# Altium schematic sheet S11830_1_1.SchDoc
size A4
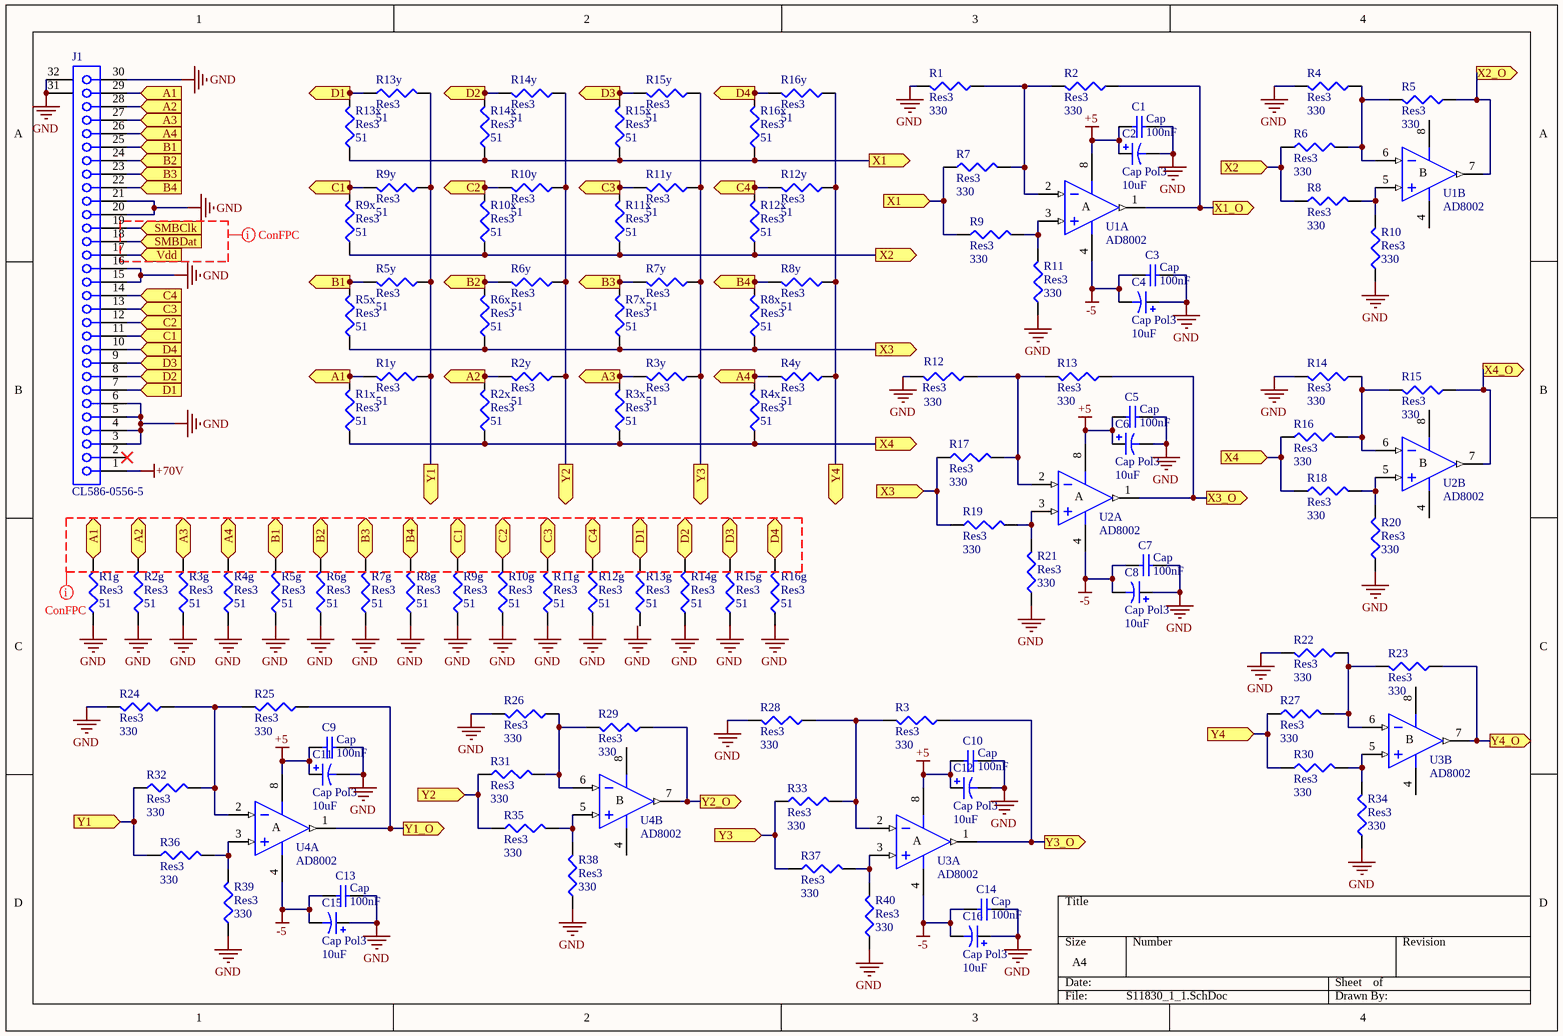
[diagram p0: S11830_1_1.SchDoc]

## Parts
C1  Cap  value 100nF  [6-0805_N]
C2  Cap Pol3  value 10uF  [6-0805_N]
C3  Cap  value 100nF  [6-0805_N]
C4  Cap Pol3  value 10uF  [6-0805_N]
C5  Cap  value 100nF  [6-0805_N]
C6  Cap Pol3  value 10uF  [6-0805_N]
C7  Cap  value 100nF  [6-0805_N]
C8  Cap Pol3  value 10uF  [6-0805_N]
C9  Cap  value 100nF  [6-0805_N]
C10  Cap  value 100nF  [6-0805_N]
C11  Cap Pol3  value 10uF  [6-0805_N]
C12  Cap Pol3  value 10uF  [6-0805_N]
C13  Cap  value 100nF  [6-0805_N]
C14  Cap  value 100nF  [6-0805_N]
C15  Cap Pol3  value 10uF  [6-0805_N]
C16  Cap Pol3  value 10uF  [6-0805_N]
J1  CL586-0556-5  [FH12A-30S-0.5SH]
R1  Res3  value 330  [J1-0603]
R1g  Res3  value 51  [0402]
R1x  Res3  value 51  [0402]
R1y  Res3  value 51  [0402]
R2  Res3  value 330  [J1-0603]
R2g  Res3  value 51  [0402]
R2x  Res3  value 51  [0402]
R2y  Res3  value 51  [0402]
R3  Res3  value 330  [J1-0603]
R3g  Res3  value 51  [0402]
R3x  Res3  value 51  [0402]
R3y  Res3  value 51  [0402]
R4  Res3  value 330  [J1-0603]
R4g  Res3  value 51  [0402]
R4x  Res3  value 51  [0402]
R4y  Res3  value 51  [0402]
R5  Res3  value 330  [J1-0603]
R5g  Res3  value 51  [0402]
R5x  Res3  value 51  [0402]
R5y  Res3  value 51  [0402]
R6  Res3  value 330  [J1-0603]
R6g  Res3  value 51  [0402]
R6x  Res3  value 51  [0402]
R6y  Res3  value 51  [0402]
R7  Res3  value 330  [J1-0603]
R7g  Res3  value 51  [0402]
R7x  Res3  value 51  [0402]
R7y  Res3  value 51  [0402]
R8  Res3  value 330  [J1-0603]
R8g  Res3  value 51  [0402]
R8x  Res3  value 51  [0402]
R8y  Res3  value 51  [0402]
R9  Res3  value 330  [J1-0603]
R9g  Res3  value 51  [0402]
R9x  Res3  value 51  [0402]
R9y  Res3  value 51  [0402]
R10  Res3  value 330  [J1-0603]
R10g  Res3  value 51  [0402]
R10x  Res3  value 51  [0402]
R10y  Res3  value 51  [0402]
R11  Res3  value 330  [J1-0603]
R11g  Res3  value 51  [0402]
R11x  Res3  value 51  [0402]
R11y  Res3  value 51  [0402]
R12  Res3  value 330  [J1-0603]
R12g  Res3  value 51  [0402]
R12x  Res3  value 51  [0402]
R12y  Res3  value 51  [0402]
R13  Res3  value 330  [J1-0603]
R13g  Res3  value 51  [0402]
R13x  Res3  value 51  [0402]
R13y  Res3  value 51  [0402]
R14  Res3  value 330  [J1-0603]
R14g  Res3  value 51  [0402]
R14x  Res3  value 51  [0402]
R14y  Res3  value 51  [0402]
R15  Res3  value 330  [J1-0603]
R15g  Res3  value 51  [0402]
R15x  Res3  value 51  [0402]
R15y  Res3  value 51  [0402]
R16  Res3  value 330  [J1-0603]
R16g  Res3  value 51  [0402]
R16x  Res3  value 51  [0402]
R16y  Res3  value 51  [0402]
R17  Res3  value 330  [J1-0603]
R18  Res3  value 330  [J1-0603]
R19  Res3  value 330  [J1-0603]
R20  Res3  value 330  [J1-0603]
R21  Res3  value 330  [J1-0603]
R22  Res3  value 330  [J1-0603]
R23  Res3  value 330  [J1-0603]
R24  Res3  value 330  [J1-0603]
R25  Res3  value 330  [J1-0603]
R26  Res3  value 330  [J1-0603]
R27  Res3  value 330  [J1-0603]
R28  Res3  value 330  [J1-0603]
R29  Res3  value 330  [J1-0603]
R30  Res3  value 330  [J1-0603]
R31  Res3  value 330  [J1-0603]
R32  Res3  value 330  [J1-0603]
R33  Res3  value 330  [J1-0603]
R34  Res3  value 330  [J1-0603]
R35  Res3  value 330  [J1-0603]
R36  Res3  value 330  [J1-0603]
R37  Res3  value 330  [J1-0603]
R38  Res3  value 330  [J1-0603]
R39  Res3  value 330  [J1-0603]
R40  Res3  value 330  [J1-0603]
U1  AD8002  [SO-8_M]  (parts A,B of 2)
U2  AD8002  [SO-8_M]  (parts A,B of 2)
U3  AD8002  [SO-8_M]  (parts A,B of 2)
U4  AD8002  [SO-8_M]  (parts A,B of 2)

## Ports
A1 (in), A1 (out), A2 (in), A2 (out), A3 (in), A3 (out), A4 (in), A4 (out), B1 (in), B1 (out), B2 (in), B2 (out), B3 (in), B3 (out), B4 (in), B4 (out), C1 (in), C1 (out), C2 (in), C2 (out), C3 (in), C3 (out), C4 (in), C4 (out), D1 (in), D1 (out), D2 (in), D2 (out), D3 (in), D3 (out), D4 (in), D4 (out), SMBClk (in), SMBDat (in), Vdd (in), X1 (in), X1 (out), X1_O (out), X2 (in), X2 (out), X2_O (out), X3 (in), X3 (out), X3_O (out), X4 (in), X4 (out), X4_O (out), Y1 (in), Y1 (out), Y1_O (out), Y2 (in), Y2 (out), Y2_O (out), Y3 (in), Y3 (out), Y3_O (out), Y4 (in), Y4 (out), Y4_O (out)

## Nets
+5: C1.2 C2.1 C5.2 C6.1 C9.2 C10.2 C11.1 C12.1 U1.8(V+) U2.8(V+) U3.8(V+) U4.8(V+)
+70V: J1.1
-5: C3.2 C4.2 C7.2 C8.2 C13.2 C14.2 C15.2 C16.2 U1.4(V-) U2.4(V-) U3.4(V-) U4.4(V-)
GND: C1.1 C2.2 C3.1 C4.1 C5.1 C6.2 C7.1 C8.1 C9.1 C10.1 C11.2 C12.2 C13.1 C14.1 C15.1 C16.1 J1.3 J1.4 J1.5 J1.6 J1.15 J1.16 J1.20 J1.21 J1.30 J1.31(MH1) J1.32(MH2) R1.2 R1g.1 R2g.1 R3g.1 R4.2 R4g.1 R5g.1 R6g.1 R7g.1 R8g.1 R9g.1 R10.1 R10g.1 R11.1 R11g.1 R12.2 R12g.1 R14.2 R14g.1 R15g.1 R16g.1 R20.1 R21.1 R22.2 R24.2 R26.2 R28.2 R34.1 R38.1 R39.1 R40.1
A1: J1.29 R1g.2 R1x.2 R1y.2 ; port A1
A2: J1.28 R2g.2 R2x.2 R2y.2 ; port A2
A3: J1.27 R3g.2 R3x.2 R3y.2 ; port A3
A4: J1.26 R4g.2 R4x.2 R4y.2 ; port A4
B1: J1.25 R5g.2 R5x.2 R5y.2 ; port B1
B2: J1.24 R6g.2 R6x.2 R6y.2 ; port B2
B3: J1.23 R7g.2 R7x.2 R7y.2 ; port B3
B4: J1.22 R8g.2 R8x.2 R8y.2 ; port B4
C1: J1.11 R9g.2 R9x.2 R9y.2 ; port C1
C2: J1.12 R10g.2 R10x.2 R10y.2 ; port C2
C3: J1.13 R11g.2 R11x.2 R11y.2 ; port C3
C4: J1.14 R12g.2 R12x.2 R12y.2 ; port C4
D1: J1.7 R13g.2 R13x.2 R13y.1 ; port D1
D2: J1.8 R14g.2 R14x.2 R14y.2 ; port D2
D3: J1.9 R15g.2 R15x.2 R15y.2 ; port D3
D4: J1.10 R16g.2 R16x.2 R16y.2 ; port D4
SMBClk: J1.19 ; port SMBClk
SMBDat: J1.18 ; port SMBDat
Vdd: J1.17 ; port Vdd
X1: R7.1 R9.1 R13x.1 R14x.1 R15x.1 R16x.1 ; port X1
X1_O: R2.1 U1.1(OUT) ; port X1_O
X2: R6.1 R8.1 R9x.1 R10x.1 R11x.1 R12x.1 ; port X2
X2_O: R5.1 U1.7(OUT) ; port X2_O
X3: R5x.1 R6x.1 R7x.1 R8x.1 R17.1 R19.1 ; port X3
X3_O: R13.1 U2.1(OUT) ; port X3_O
X4: R1x.1 R2x.1 R3x.1 R4x.1 R16.1 R18.1 ; port X4
X4_O: R15.1 U2.7(OUT) ; port X4_O
Y1: R1y.1 R5y.1 R9y.1 R13y.2 R32.1 R36.1 ; port Y1
Y1_O: R25.1 U4.1(OUT) ; port Y1_O
Y2: R2y.1 R6y.1 R10y.1 R14y.1 R31.1 R35.1 ; port Y2
Y2_O: R29.1 U4.7(OUT) ; port Y2_O
Y3: R3y.1 R7y.1 R11y.1 R15y.1 R33.1 R37.1 ; port Y3
Y3_O: R3.1 U3.1(OUT) ; port Y3_O
Y4: R4y.1 R8y.1 R12y.1 R16y.1 R27.1 R30.1 ; port Y4
Y4_O: R23.1 U3.7(OUT) ; port Y4_O
NetR1_1: R1.1 R2.2 R7.2 U1.2(IN-)
NetR3_2: R3.2 R28.1 R33.2 U3.2(IN-)
NetR4_1: R4.1 R5.2 R6.2 U1.6(IN-)
NetR8_2: R8.2 R10.2 U1.5(IN+)
NetR9_2: R9.2 R11.2 U1.3(IN+)
NetR12_1: R12.1 R13.2 R17.2 U2.2(IN-)
NetR14_1: R14.1 R15.2 R16.2 U2.6(IN-)
NetR18_2: R18.2 R20.2 U2.5(IN+)
NetR19_2: R19.2 R21.2 U2.3(IN+)
NetR22_1: R22.1 R23.2 R27.2 U3.6(IN-)
NetR24_1: R24.1 R25.2 R32.2 U4.2(IN-)
NetR26_1: R26.1 R29.2 R31.2 U4.6(IN-)
NetR30_2: R30.2 R34.2 U3.5(IN+)
NetR35_2: R35.2 R38.2 U4.5(IN+)
NetR36_2: R36.2 R39.2 U4.3(IN+)
NetR37_2: R37.2 R40.2 U3.3(IN+)

Not connected (* = marked no-connect by the designer): J1 2*; R13g 1

## Layout directives
net class Undefined: (no net found under the mark)

## Notes on the sheet
- Labels drawn without touching a wire or pin: GND
- (in symbol AD8002AR, part A) A
- (in symbol AD8002AR, part B) B

## Library data of the parts
C1 C3 C5 C7 C9 C10 C13 C14 = Cap: Capacitor; Published: 8-Jun-2000; LatestRevisionDate: 17-Jul-2002; LatestRevisionNote: Re-released for DXP Platform.; PackageReference: RAD-0.3; Publisher: Altium Limited; PackageDescription: Radial Cap, Thru-Hole; 2 Leads; 0.3 in Pin Spacing
C2 C4 C6 C8 C11 C12 C15 C16 = Cap Pol3: Polarized Capacitor (Surface Mount); Published: 8-Jun-2000; LatestRevisionDate: 29-May-2009; LatestRevisionNote: IPC-7351 Footprint Added.; PackageReference: C0805; Publisher: Altium Limited; PackageDescription: Chip Capacitor
J1 = CL586-0556-5: FH12 Series, "Flip-Lock" SMT/ZIF FFC/FPC Connector - 0.5mm Spaced Top Contact; Positions: 30; ContactMaterial: Phosphor Bronze; Current: 0.4A; PCB_Layout: Complies with manufacturer's recommendation.; Note: Pad dimensions follow nominal values, Suitable for Wave Soldering, Adjust for Re-flow.; Published: 17-Jul-2002; DatasheetVersion: 13-Nov-2000; PackageVersion: 13-Nov-2000; PackageReference: FH12A-30S-0.5SH; Publisher: Altium Limited; ComponentLink1Description: Manufacturer Link; ComponentLink1URL: http://www.hiroseusa.com/; ComponentLink2Description: Datasheet; ComponentLink2URL: http://www.hirose.co.jp/cataloge_hp/e58605370.pdf
R1 R1g R1x R1y R2 R2g R2x R2y R3 R3g R3x R3y R4 R4g R4x R4y R5 R5g R5x R5y R6 R6g R6x R6y R7 R7g R7x R7y R8 R8g R8x R8y R9 R9g R9x R9y R10 R10g R10x R10y R11 R11g R11x R11y R12 R12g R12x R12y R13 R13g R13x R13y R14 R14g R14x R14y R15 R15g R15x R15y R16 R16g R16x R16y R17-R40 = Res3: Resistor; Published: 8-Jun-2000; LatestRevisionDate: 29-May-2009; LatestRevisionNote: IPC-7351 Footprint Added.; PackageReference: J1-0603; Publisher: Altium Limited; PackageDescription: Chip Resistor
U1-U4 = AD8002AR: Dual 600MHz, 50mW Current Feedback Amplifier; Published: 8-Jun-2000; LatestRevisionDate: 13-Apr-2006; LatestRevisionNote: IPC-7351 Footprint Added.; DatasheetVersion: REV. C 1999; PackageVersion: revA; PackageReference: SO-8; Publisher: Altium Limited; PackageDescription: 8-Pin Small Outline Integrated Circuit 1.27 mm Pitch; Code_JEDEC: MS-012-AA; Code_IPC: SOIC127P600-8; ComponentLink1Description: Manufacturer Link; ComponentLink1URL: http://www.analog.com/en/prod/0,,759_786_AD8002%2C00.html; ComponentLink2Description: Datasheet; ComponentLink2URL: http://www.analog.com/UploadedFiles/Data_Sheets/147523773AD8002_d.pdf